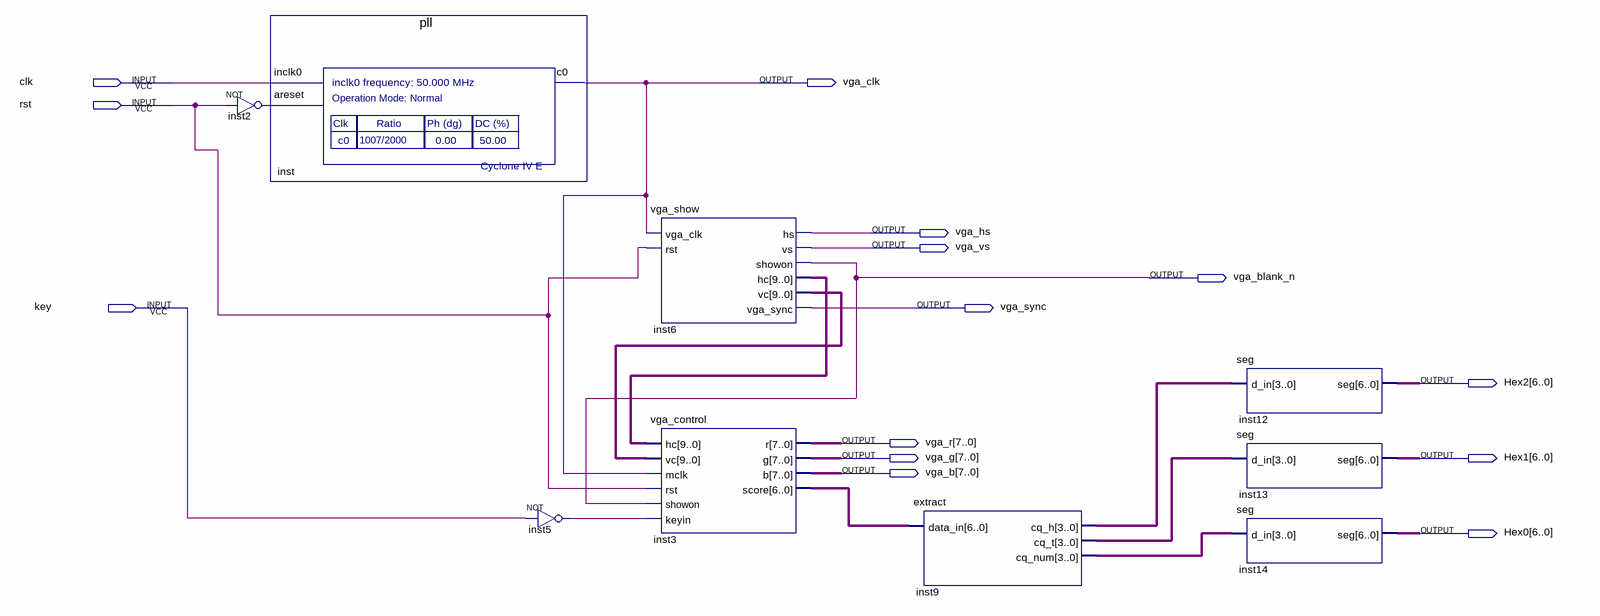
[diagram p0: schematic sheet]
// Quartus schematic FlappyBird.bdf as structural Verilog: 9 symbols, 14 pins
module FlappyBird (
  input  clk,
  input  rst,
  input  key,
  output vga_clk,
  output vga_hs,
  output vga_vs,
  output vga_blank_n,
  output vga_sync,
  output [6:0] Hex2,
  output [7:0] vga_r,
  output [7:0] vga_g,
  output [6:0] Hex1,
  output [7:0] vga_b,
  output [6:0] Hex0
);

  wire inst2_out, inst5_out;
  wire [3:0] inst9_cq_h, inst9_cq_num, inst9_cq_t;
  wire [6:0] inst3_score;
  wire [9:0] inst6_hc, inst6_vc;

  not inst2 (inst2_out, rst);
  pll inst (.inclk0(clk), .areset(inst2_out), .c0(vga_clk));
  not inst5 (inst5_out, key);
  vga_show inst6 (
    .vga_clk(vga_clk), .rst(rst), .hs(vga_hs), .vs(vga_vs), .showon(vga_blank_n), .hc(inst6_hc),
    .vc(inst6_vc), .vga_sync(vga_sync));
  vga_control inst3 (
    .hc(inst6_hc), .vc(inst6_vc), .mclk(vga_clk), .rst(rst), .showon(vga_blank_n), .keyin(inst5_out),
    .r(vga_r), .g(vga_g), .b(vga_b), .score(inst3_score));
  extract inst9 (.data_in(inst3_score), .cq_h(inst9_cq_h), .cq_t(inst9_cq_t), .cq_num(inst9_cq_num));
  seg inst12 (.d_in(inst9_cq_h), .seg(Hex2));
  seg inst13 (.d_in(inst9_cq_t), .seg(Hex1));
  seg inst14 (.d_in(inst9_cq_num), .seg(Hex0));
endmodule
